# Altium schematic sheet N_FET.SchDoc
size 1270 x 241 mm
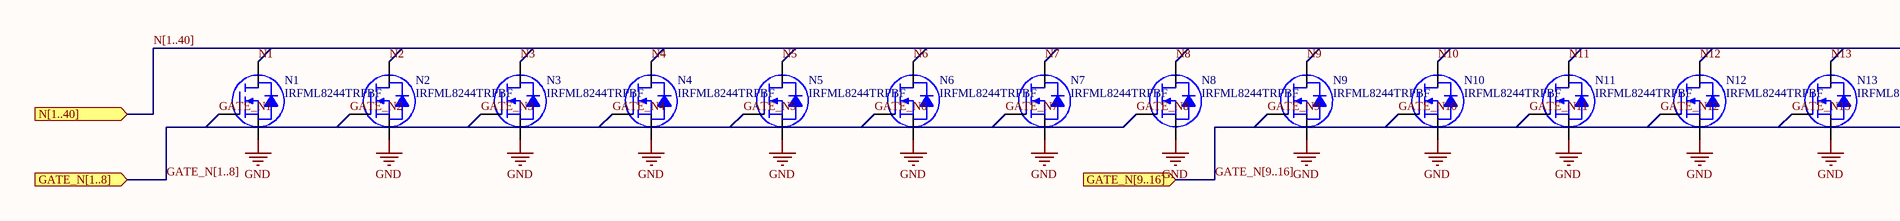
[diagram p0: N_FET.SchDoc, left]
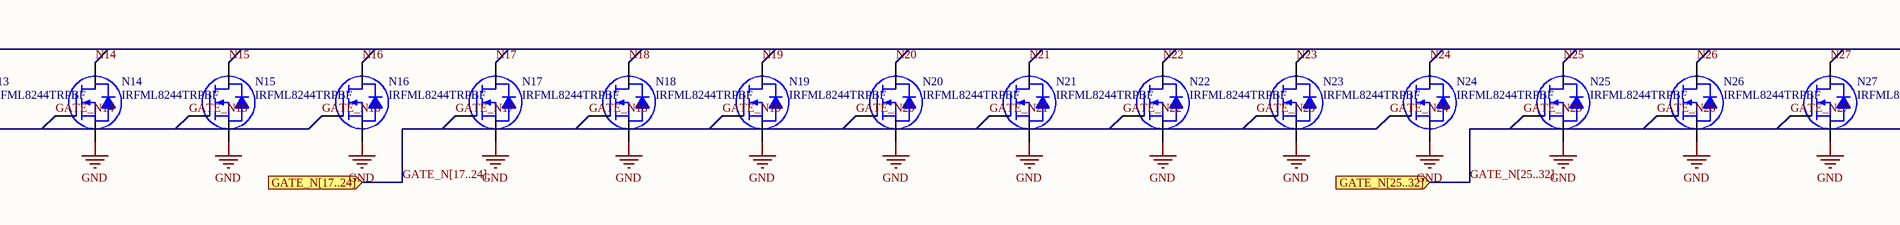
[diagram p1: N_FET.SchDoc, middle]
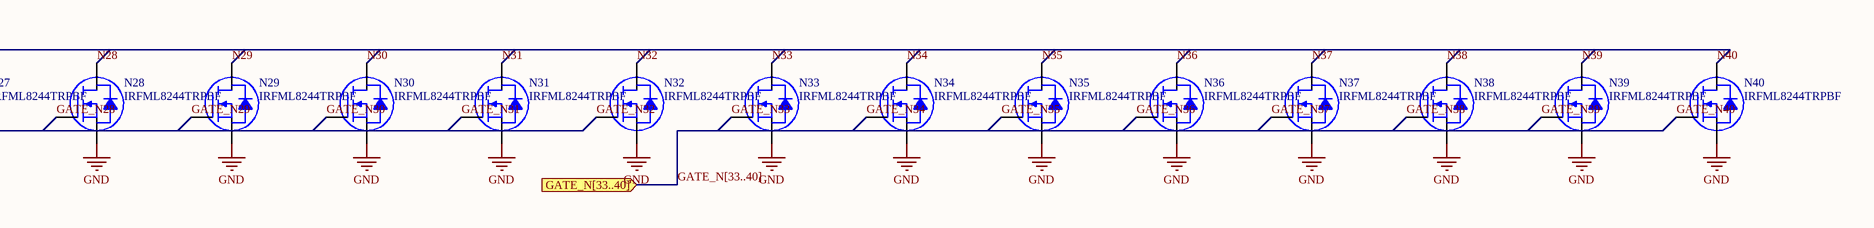
[diagram p2: N_FET.SchDoc, right]

## Parts
N1  IRFML8244TRPBF  [INFINEON SOT-23-3]
N2  IRFML8244TRPBF  [INFINEON SOT-23-3]
N3  IRFML8244TRPBF  [INFINEON SOT-23-3]
N4  IRFML8244TRPBF  [INFINEON SOT-23-3]
N5  IRFML8244TRPBF  [INFINEON SOT-23-3]
N6  IRFML8244TRPBF  [INFINEON SOT-23-3]
N7  IRFML8244TRPBF  [INFINEON SOT-23-3]
N8  IRFML8244TRPBF  [INFINEON SOT-23-3]
N9  IRFML8244TRPBF  [INFINEON SOT-23-3]
N10  IRFML8244TRPBF  [INFINEON SOT-23-3]
N11  IRFML8244TRPBF  [INFINEON SOT-23-3]
N12  IRFML8244TRPBF  [INFINEON SOT-23-3]
N13  IRFML8244TRPBF  [INFINEON SOT-23-3]
N14  IRFML8244TRPBF  [INFINEON SOT-23-3]
N15  IRFML8244TRPBF  [INFINEON SOT-23-3]
N16  IRFML8244TRPBF  [INFINEON SOT-23-3]
N17  IRFML8244TRPBF  [INFINEON SOT-23-3]
N18  IRFML8244TRPBF  [INFINEON SOT-23-3]
N19  IRFML8244TRPBF  [INFINEON SOT-23-3]
N20  IRFML8244TRPBF  [INFINEON SOT-23-3]
N21  IRFML8244TRPBF  [INFINEON SOT-23-3]
N22  IRFML8244TRPBF  [INFINEON SOT-23-3]
N23  IRFML8244TRPBF  [INFINEON SOT-23-3]
N24  IRFML8244TRPBF  [INFINEON SOT-23-3]
N25  IRFML8244TRPBF  [INFINEON SOT-23-3]
N26  IRFML8244TRPBF  [INFINEON SOT-23-3]
N27  IRFML8244TRPBF  [INFINEON SOT-23-3]
N28  IRFML8244TRPBF  [INFINEON SOT-23-3]
N29  IRFML8244TRPBF  [INFINEON SOT-23-3]
N30  IRFML8244TRPBF  [INFINEON SOT-23-3]
N31  IRFML8244TRPBF  [INFINEON SOT-23-3]
N32  IRFML8244TRPBF  [INFINEON SOT-23-3]
N33  IRFML8244TRPBF  [INFINEON SOT-23-3]
N34  IRFML8244TRPBF  [INFINEON SOT-23-3]
N35  IRFML8244TRPBF  [INFINEON SOT-23-3]
N36  IRFML8244TRPBF  [INFINEON SOT-23-3]
N37  IRFML8244TRPBF  [INFINEON SOT-23-3]
N38  IRFML8244TRPBF  [INFINEON SOT-23-3]
N39  IRFML8244TRPBF  [INFINEON SOT-23-3]
N40  IRFML8244TRPBF  [INFINEON SOT-23-3]

## Ports
GATE_N[1..8] (in), GATE_N[9..16] (in), GATE_N[17..24] (in), GATE_N[25..32] (in), GATE_N[33..40] (in), N[1..40] (in)

## Nets
GND: N1.3(S) N2.3(S) N3.3(S) N4.3(S) N5.3(S) N6.3(S) N7.3(S) N8.3(S) N9.3(S) N10.3(S) N11.3(S) N12.3(S) N13.3(S) N14.3(S) N15.3(S) N16.3(S) N17.3(S) N18.3(S) N19.3(S) N20.3(S) N21.3(S) N22.3(S) N23.3(S) N24.3(S) N25.3(S) N26.3(S) N27.3(S) N28.3(S) N29.3(S) N30.3(S) N31.3(S) N32.3(S) N33.3(S) N34.3(S) N35.3(S) N36.3(S) N37.3(S) N38.3(S) N39.3(S) N40.3(S)
GATE_N1: N1.1(G)
GATE_N2: N2.1(G)
GATE_N3: N3.1(G)
GATE_N4: N4.1(G)
GATE_N5: N5.1(G)
GATE_N6: N6.1(G)
GATE_N7: N7.1(G)
GATE_N8: N8.1(G)
GATE_N9: N9.1(G)
GATE_N10: N10.1(G)
GATE_N11: N11.1(G)
GATE_N12: N12.1(G)
GATE_N13: N13.1(G)
GATE_N14: N14.1(G)
GATE_N15: N15.1(G)
GATE_N16: N16.1(G)
GATE_N17: N17.1(G)
GATE_N18: N18.1(G)
GATE_N19: N19.1(G)
GATE_N20: N20.1(G)
GATE_N21: N21.1(G)
GATE_N22: N22.1(G)
GATE_N23: N23.1(G)
GATE_N24: N24.1(G)
GATE_N25: N25.1(G)
GATE_N26: N26.1(G)
GATE_N27: N27.1(G)
GATE_N28: N28.1(G)
GATE_N29: N29.1(G)
GATE_N30: N30.1(G)
GATE_N31: N31.1(G)
GATE_N32: N32.1(G)
GATE_N33: N33.1(G)
GATE_N34: N34.1(G)
GATE_N35: N35.1(G)
GATE_N36: N36.1(G)
GATE_N37: N37.1(G)
GATE_N38: N38.1(G)
GATE_N39: N39.1(G)
GATE_N40: N40.1(G)
N1: N1.2(D)
N2: N2.2(D)
N3: N3.2(D)
N4: N4.2(D)
N5: N5.2(D)
N6: N6.2(D)
N7: N7.2(D)
N8: N8.2(D)
N9: N9.2(D)
N10: N10.2(D)
N11: N11.2(D)
N12: N12.2(D)
N13: N13.2(D)
N14: N14.2(D)
N15: N15.2(D)
N16: N16.2(D)
N17: N17.2(D)
N18: N18.2(D)
N19: N19.2(D)
N20: N20.2(D)
N21: N21.2(D)
N22: N22.2(D)
N23: N23.2(D)
N24: N24.2(D)
N25: N25.2(D)
N26: N26.2(D)
N27: N27.2(D)
N28: N28.2(D)
N29: N29.2(D)
N30: N30.2(D)
N31: N31.2(D)
N32: N32.2(D)
N33: N33.2(D)
N34: N34.2(D)
N35: N35.2(D)
N36: N36.2(D)
N37: N37.2(D)
N38: N38.2(D)
N39: N39.2(D)
N40: N40.2(D)

## Buses and harness runs
bus GATE_N[1..8] = port GATE_N[1..8]
bus GATE_N[9..16] = port GATE_N[9..16]
bus GATE_N[17..24] = port GATE_N[17..24]
bus GATE_N[25..32] = port GATE_N[25..32]
bus GATE_N[33..40] = port GATE_N[33..40]
bus N[1..40] = port N[1..40]

## Library data of the parts
N1-N40 = IRFML8244TRPBF: MOSFET N-CH 25V 5.8A SOT23; Manufacturer: Infineon Technologies; Rds On (Max) at Id, Vgs: 24 mOhm @ 5.8A, 10V; Vgs(th) (Max) at Id: 20V; Gate Charge (Qg): 5.4nC @ 10V; Input Capacitance (Ciss) at Vds: 430pF @ 10V; Current Continuous Drain: 5.8A (Ta); Part Number: IRFML8244TRPBF; PartId: 29462; Supplier 1: Digi-Key; Supplier Part Number 1: IRFML8244TRPBFCT-ND; ComponentLink1Description: Datasheet; ComponentLink1URL: http://www.irf.com/product-info/datasheets/data/irfml8244pbf.pdf; ComponentLink2Description: Digi-Key Listing; ComponentLink2URL: https://www.digikey.com/product-detail/en/infineon-technologies/IRFML8244TRPBF/IRFML8244TRPBFCT-ND/2538166; Price: .67; Type: N-Channel; Device Package: TO-236-3, SC-59, SOT-23-3; Drain to Source Voltage (Vdss): 25V